# EAGLE design tht-fet-board (EAGLE 7.7.0)
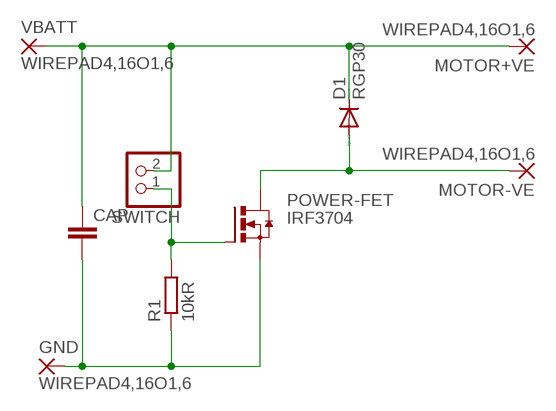
[diagram p0: schematic, sheet 1]

## Parts
CAP  C-EU025-024X044  [C025-024X044]
D1  RGP30  [DO201-15]
GND  WIREPAD4,16O1,6  [4,16O1,6]
MOTOR+VE  WIREPAD4,16O1,6  [4,16O1,6]
MOTOR-VE  WIREPAD4,16O1,6  [4,16O1,6]
POWER-FET  IRF3704  [TO220AH]
R1  10kR  R-EU_0207/15  [0207/15]
SWITCH  PINHD-1X2  [1X02]
VBATT  WIREPAD4,16O1,6  [4,16O1,6]

## Nets
GATE: POWER-FET.B(G) R1.2 SWITCH.1
GND: CAP.2 GND.1(P) POWER-FET.E(S) R1.1
MOTOR-VE: D1.A MOTOR-VE.1(P) POWER-FET.C(D)
VBATT: CAP.1 D1.C MOTOR+VE.1(P) SWITCH.2 VBATT.1(P)

## Library data of the parts
CAP = resistor:C-EU: CAPACITOR, European symbol
D1 = diode:RGP30: DIODE fast-recovery rectifier
GND MOTOR+VE MOTOR-VE VBATT = wirepad:WIREPAD: Wire PAD connect wire on PCB
POWER-FET = transistor-power:IRF3704: SMPS MOSFET HEXFET® Power MOSFET Source: http://www.irf.com/product-info/datasheets/data/irf3704.pdf
R1 = resistor:R-EU_: RESISTOR, European symbol
SWITCH = pinhead:PINHD-1X2: PIN HEADER

## Board
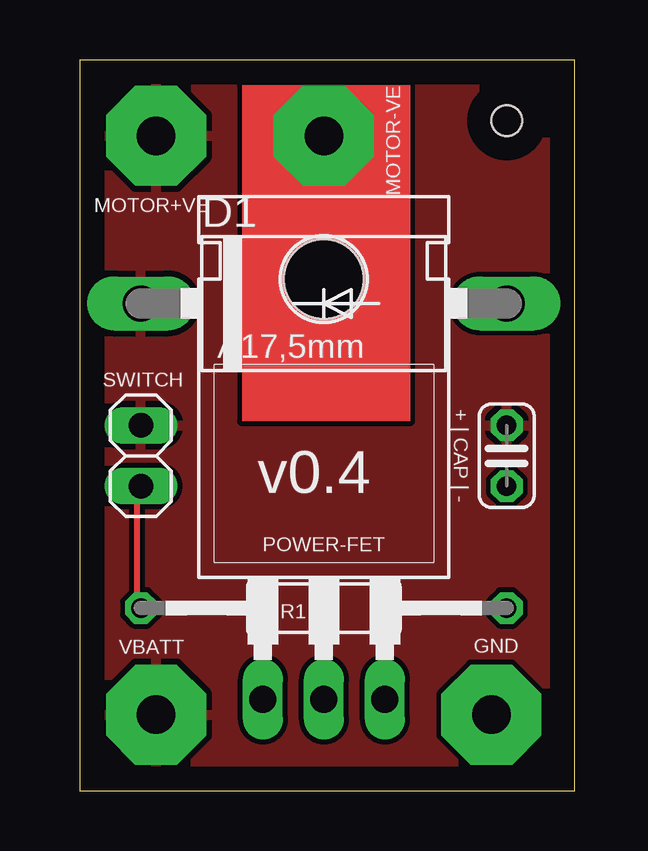
[diagram p1: board, top side]
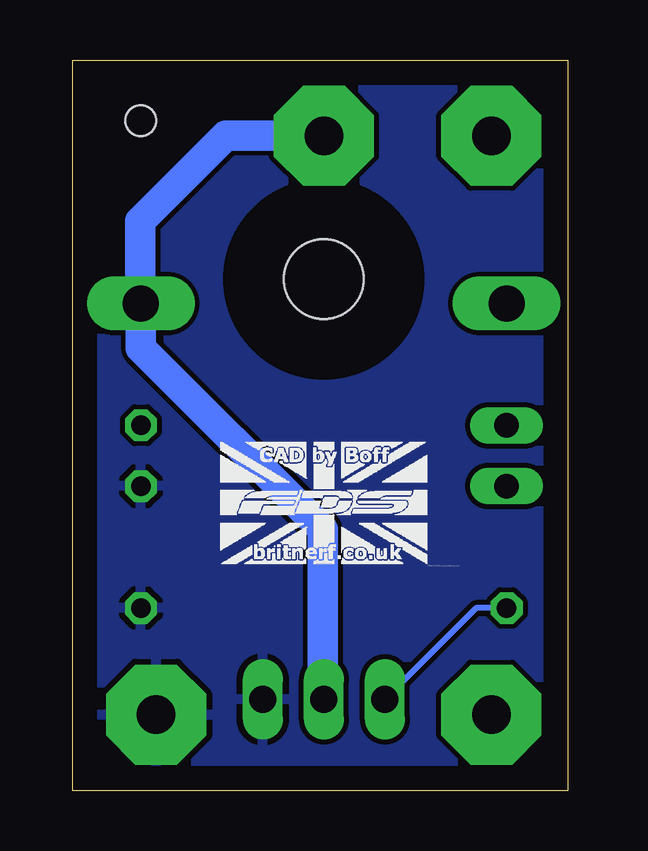
[diagram p2: board, bottom side, seen from below]

Size 20.62 x 30.47 mm. Coordinates in mm from the lower left corner, seen from the top.
Outline: 0,0 20.62,0 20.62,30.47 0,30.47 0,0
Copper layers (1*16): Top 0.035mm / dielectric 1.5mm / Bottom 0.035mm
Design rules "default": minimum track width 10mil, minimum drill 24mil, track to track 8mil, track to pad 8mil, pad to pad 8mil, via to via 8mil, smd to smd 8mil, copper to edge 40mil, drill to drill 8mil, minimum pad ring 10mil, minimum via ring 8mil, stop-mask expansion 4mil, vias tented up to drill 0mil, thermal gap 10mil
Holes 1.27 mm at 17.78,27.94

### Footprints (pad centres in the part's own frame; a part is rotated, then mirrored left to right if it is on the bottom)
C025-024X044 = drill 0.813 octagon: 1 -1.27,0; 2 1.27,0
DO201-15 = drill 1.499 long: A 7.62,0; C -7.62,0
4,16O1,6 = drill 1.6 pad 4.166 octagon: 1 0,0
TO220AH = drill 1.118 long: B -2.54,-6.35; C 0,-6.35; E 2.54,-6.35 | hole 3.302: 0,11.176
0207/15 = drill 0.813 octagon: 1 -7.62,0; 2 7.62,0
1X02 = drill 1.016 long: 1 -1.27,0; 2 1.27,0

### Placement (x,y rotation side)
CAP  17.78,13.97 270 top
D1  10.16,20.32 0 top
GND  17.14,3.18 0 top
MOTOR+VE  3.17,27.31 0 top
MOTOR-VE  10.16,27.31 0 top
POWER-FET  10.16,10.16 0 top
R1  10.16,7.62 180 top
SWITCH  2.54,13.97 90 top
VBATT  3.17,3.18 0 top

### Tracks (layer width: path | path; a pad name or v marks a point on that pad's centre or on a via)
GATE
  Top 0.254: R1.2 2.36,7.67 2.36,12.7 SWITCH.1
  Bottom 0.254: R1.2 3.81,7.62 POWER-FET.B
GND
  pour Bottom: 0,30.48 20.32,30.48 20.32,0 0,0
MOTOR-VE
  Bottom 0.406: 17.8,20.35 D1.A
  Bottom 1.27: MOTOR-VE.1 14.25,27.31 17.8,23.75 17.8,20.35 | D1.A 17.78,18.47 10.21,10.9 10.21,3.86 POWER-FET.C
VBATT
  pour Top: 0,30.48 20.32,30.48 20.32,0 0,0
(copper drawn outside any net)
  shapes: Top area x1

### Text on the board
tNames: + | CAP | - | v0.4
bNames: C:/Users/Boff/Desktop/pcblogobmp.bmp